# Altium schematic sheet Modular_BO.SchDoc
size C; SheetNumber: 3; SheetTotal: 4
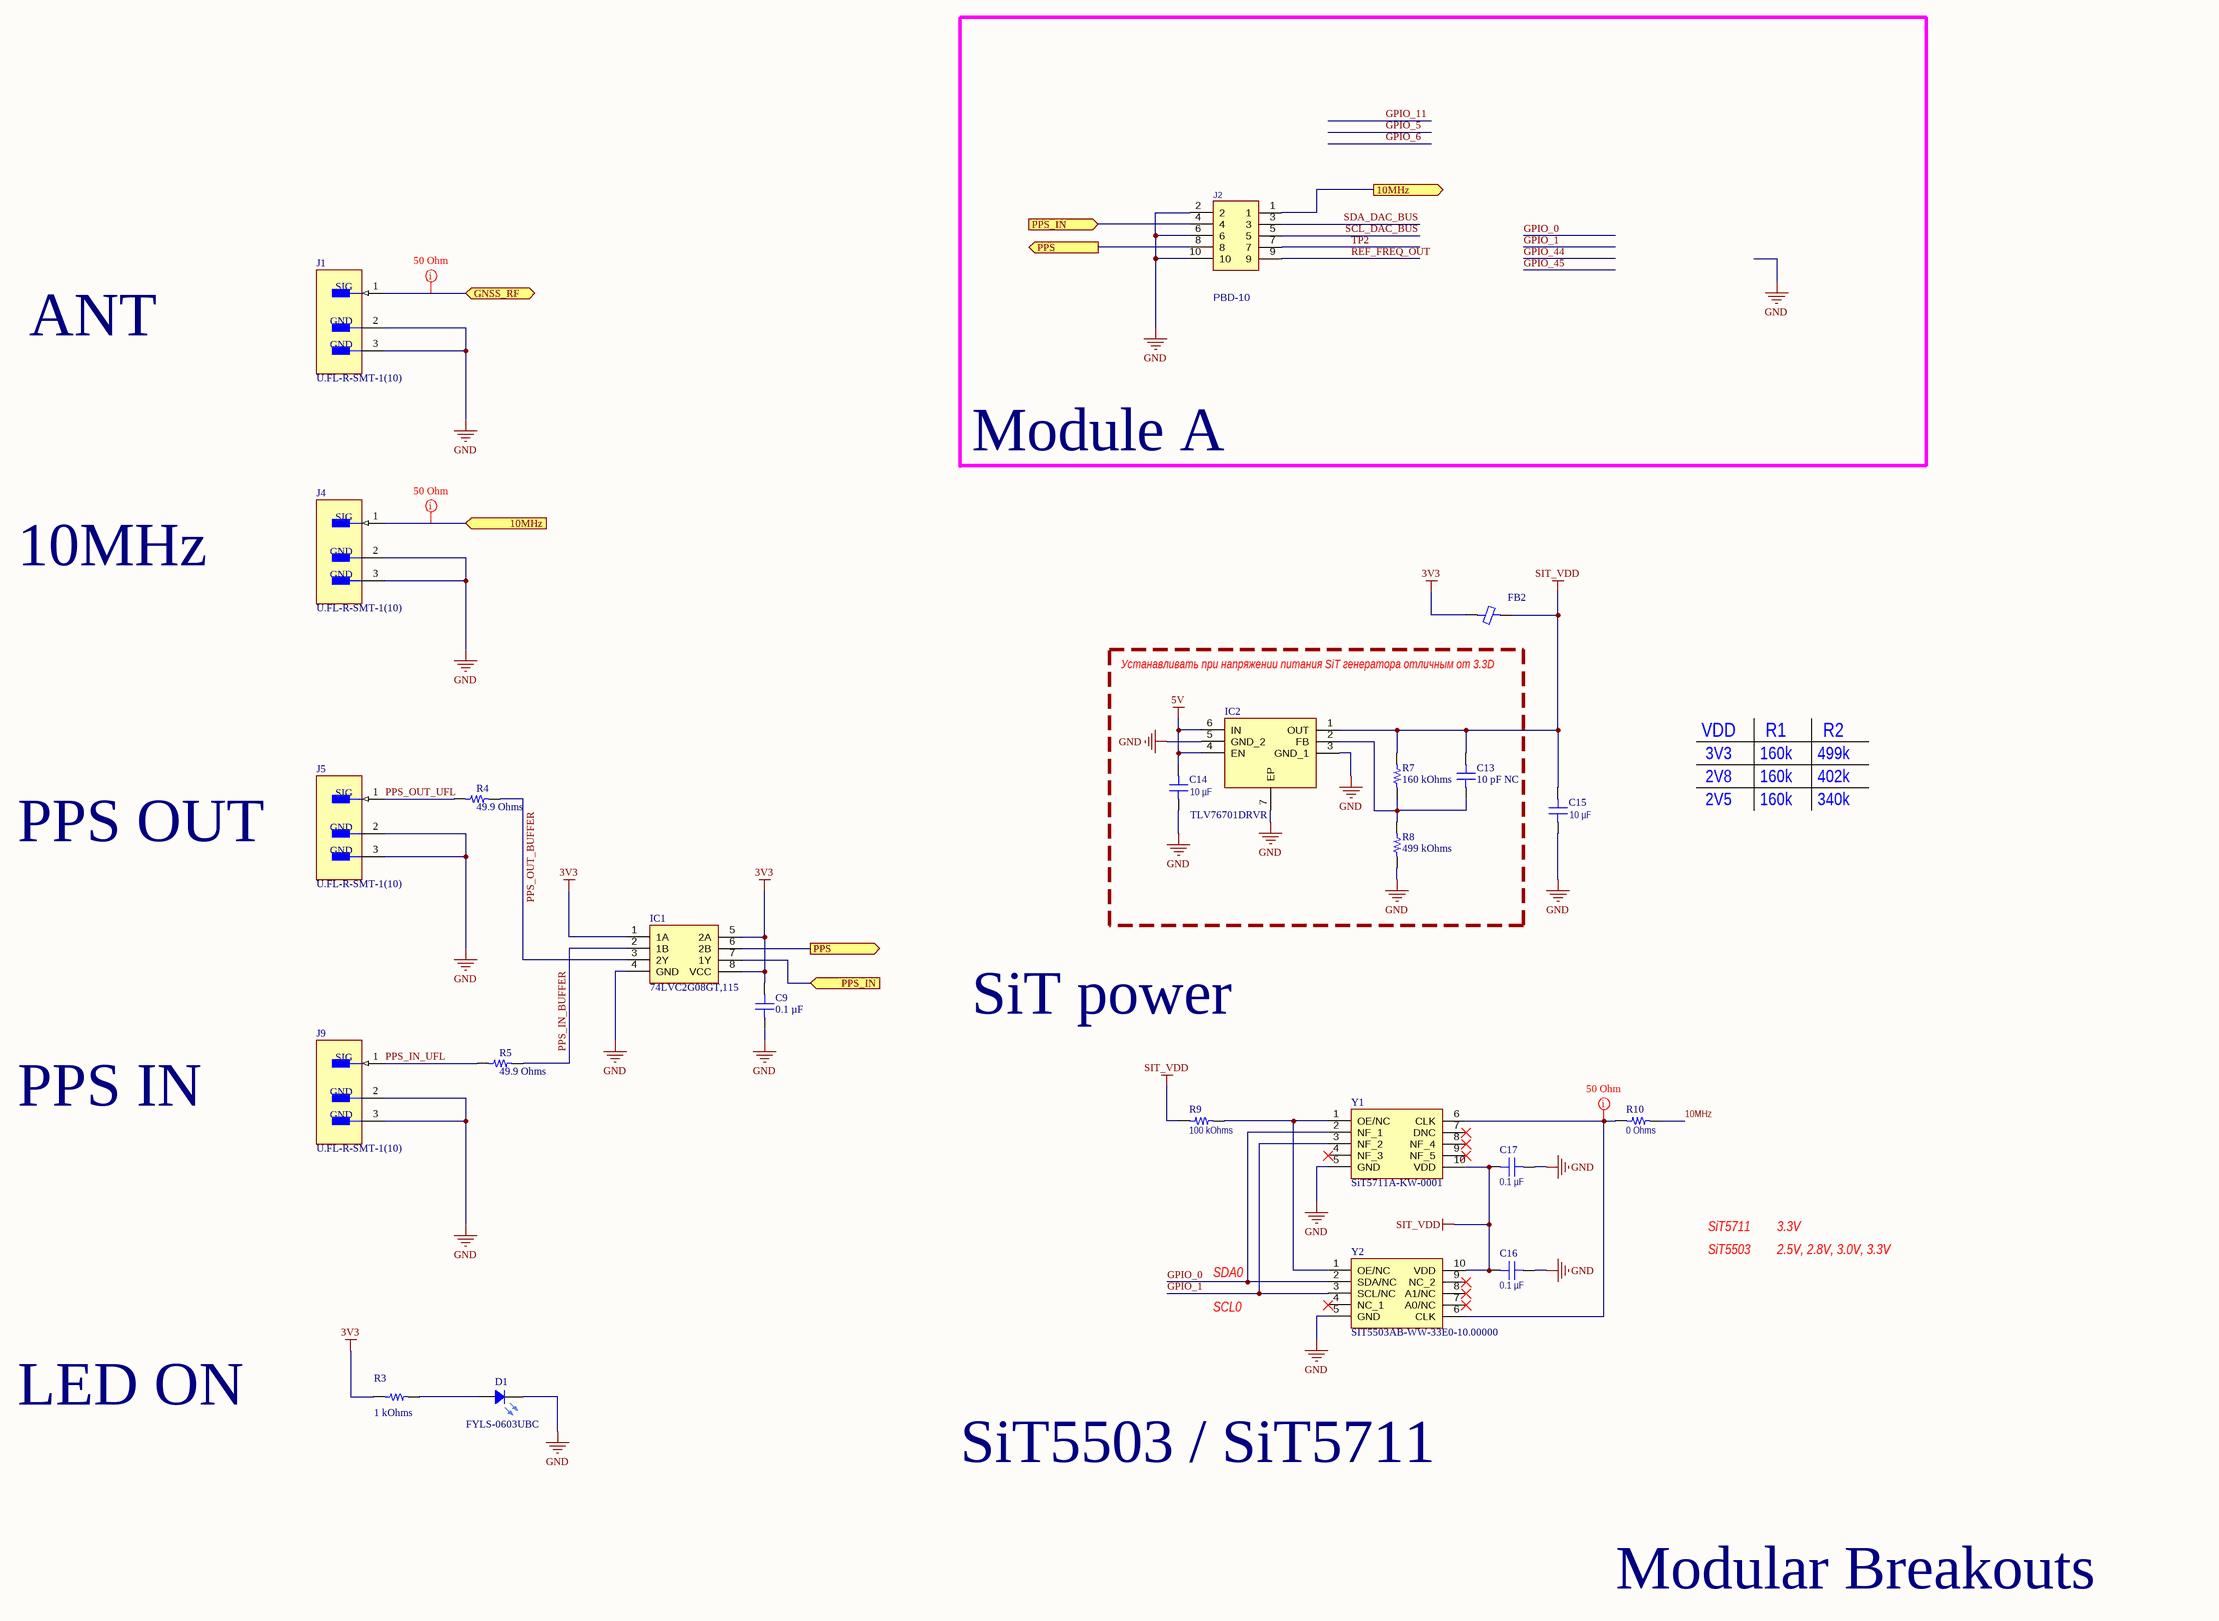
[diagram p0: Modular_BO.SchDoc]

## Parts
C9  0.1 µF  [CAP 0603_1608]
C13  10 pF NC  [CAP 0402_1005]
C14  Capacitance: 10 µF  [CAP 0603_1608]  (hidden comment: CC0603MRX5R6BB106)
C15  Capacitance: 10 µF  [CAP 0603_1608]  (hidden comment: CC0603MRX5R6BB106)
C16  0.1 µF  [CAP 0603_1608]
C17  0.1 µF  [CAP 0603_1608]
D1  FYLS-0603UBC  [LEDC1608X55N_BLUE]
FB2  1 kOhms @ 100 MHz  [FER 0603_1608]  (value not drawn)
IC1  74LVC2G08GT,115  [74AVC9112GTX]
IC2  TLV76701DRVR  [SON65P200X200X80-7N]
J1  U.FL-R-SMT-1(10)  [FP-U_FL-R-SMT-1_10-MFG]
J2  PBD-10  [PBD-10]
J4  U.FL-R-SMT-1(10)  [FP-U_FL-R-SMT-1_10-MFG]
J5  U.FL-R-SMT-1(10)  [FP-U_FL-R-SMT-1_10-MFG]
J9  U.FL-R-SMT-1(10)  [FP-U_FL-R-SMT-1_10-MFG]
R3  1 kOhms  [YAGEO RES 0603_1608]
R4  49.9 Ohms  [YAGEO RES 0603_1608]
R5  49.9 Ohms  [YAGEO RES 0603_1608]
R7  160 kOhms  [YAGEO RES 0402_1005]
R8  499 kOhms  [YAGEO RES 0402_1005]
R9  100 kOhms  [YAGEO RES 0603_1608]
R10  0 Ohms  [YAGEO RES 0603_1608]
Y1  SiT5711A-KW-0001  [Emerald_9070_10pins_2022]
Y2  SIT5503AB-WW-33E0-10.00000  [Ceramic_QFN_7050_10pins]

## Blocks framed on the sheet
Module A: J2

## Ports
10MHz (in), 10MHz (out), GNSS_RF (bidir), PPS (out), PPS_IN (in)

## Nets
3V3: C9.2 FB2.1 IC1.1(1A) IC1.5(2A) IC1.8(VCC) R3.1
5V: C14.2 IC2.4(EN) IC2.6(IN)
GND: C9.1 C14.1 C15.1 C16.1 C17.1 D1.1(A) IC1.4(GND) IC2.3(GND_1) IC2.5(GND_2) IC2.7(EP) J1.2(GND) J1.3(GND) J2.2 J2.6 J2.10 J4.2(GND) J4.3(GND) J5.2(GND) J5.3(GND) J9.2(GND) J9.3(GND) R8.1 Y1.5(GND) Y2.5(GND)
SIT_VDD: C13.2 C15.2 C16.2 C17.2 FB2.2 IC2.1(OUT) R7.2 R9.1 Y1.10(VDD) Y2.10(VDD)
10MHz: J2.1 J4.1(SIG) ; port 10MHz
10MHz: R10.1  [a separate net that carries the same name]
GNSS_RF: J1.1(SIG) ; port GNSS_RF
GPIO_0: Y1.2(NF_1) Y2.2(SDA/NC)
GPIO_1: Y1.3(NF_2) Y2.3(SCL/NC)
PPS: IC1.6(2B) J2.8 ; port PPS
PPS_IN: IC1.7(1Y) J2.4 ; port PPS_IN
PPS_IN_BUFFER: IC1.2(1B) R5.2
PPS_IN_UFL: J9.1(SIG) R5.1
PPS_OUT_BUFFER: IC1.3(2Y) R4.2
PPS_OUT_UFL: J5.1(SIG) R4.1
REF_FREQ_OUT: J2.9
SCL_DAC_BUS: J2.5
SDA_DAC_BUS: J2.3
TP2: J2.7
NetC13_1: C13.1 IC2.2(FB) R7.1 R8.2
NetD1_2: D1.2(C) R3.2
NetR9_2: R9.2 Y1.1(OE/NC) Y2.1(OE/NC)
NetR10_2: R10.2 Y1.6(CLK) Y2.6(CLK)

Not connected (* = marked no-connect by the designer): Y1 4(NF_3)* 7(DNC)* 8(NF_4)* 9(NF_5)*; Y2 4(NC_1)* 7(A0/NC)* 8(A1/NC)* 9(NC_2)*

## Layout directives
net class RF: 10MHz, GNSS_RF, NetR10_2

## Notes on the sheet
- ANT
- 10MHz
- Устанавливать при напряжении питания SiT генератора отличным от 3.3D
- VDD
- 3V3
- R1
- 160k
- R2
- 499k
- 2V5
- 2V8
- 402k
- 340k
- PPS OUT
- SiT power
- PPS IN
- SiT5711
- SiT5503
- 3.3V
- 2.5V, 2.8V, 3.0V, 3.3V
- SDA0
- SCL0
- LED ON
- SiT5503 / SiT5711
- Modular Breakouts
- DWG. NO.
- REV.
- SHT.
- REVISION
- DESCRIPTION
- DATE
- APPROVED
- THIS DOCUMENT AND THE DATA DISCLOSED HEREIN OR HEREWITH IS THE PROPERTY OF ALTIUM LIMITED AND MAY BE FREELY DISTRIBUTED IN WHOLE. NO RIGHTS ARE RESERVED OR EXPRESS OR IMPLIED WARANTEE GIVEN.
- ENG:
- DSN:
- APPROVALS
- PROJECT
- DOCUMENT REVISION:
- DESIGN ITEM:
- CHK:
- BOM:
- REFERENCE DOCUMENTS
- PROJECT REVISION:
- TITLE
- FAB DWG:
- PCB DWG:
- ASSY DWG:
- SCALE:
- SIZE
- C
- CAGE CODE
- FILE NAME
- DWG NO.
- SHEET
- OF
- REV

## Library data of the parts
C9 C16 C17 = CC0603KRX7R9BB104: CAP CER 0.1UF 50V X7R 0603; manufacturer: Yageo; Tolerance: ±10%; componentlink2url: https://www.digikey.com/en/products/detail/yageo/CC0603KRX7R9BB104/2103082; Value: 0.1 µF; componentlink2description: DigiKey Link; Temperature Coefficient: X7R; Capacitance: 0.1 µF; Part Number: CC0603KRX7R9BB104; Applications: General Purpose; componentlink1description: Datasheet; componentlink1url: https://www.yageo.com/upload/media/product/productsearch/datasheet/mlcc/UPY-GPHC_X7R_6.3V-to-50V_18.pdf; Device Package: 0603 (1608 Metric); lastupdated: 09.02.2024 20:10:21; Lifecycle Status: Active; Minimum Order: 1; Mounting Type: Surface Mount, MLCC; Operating Temperature: -55°C ~ 125°C; Package / Case: 0603 (1608 Metric); packaging: TapeAndReel; partid: 9506; Part Status: Active; price: 0.01; series: CC; Size / Dimension: 0.063" L x 0.031" W (1.60mm x 0.80mm); Supplier 1: DigiKey; Supplier Part Number 1: 311-1344-1-ND; Thickness (Max): 0.035" (0.90mm); Voltage - Rated: 50V
C13 = CC0402KRNPO9BN100: CAP CER 10PF 50V C0G/NPO 0402; manufacturer: Yageo; Temperature Coefficient: C0G, NP0; Tolerance: ±10%; Part Number: CC0402KRNPO9BN100; Value: 10 pF NC; Applications: General Purpose; Capacitance: 10 pF; componentlink1description: Datasheet; componentlink1url: https://www.yageo.com/upload/media/product/productsearch/datasheet/mlcc/UPY-GP_NP0_16V-to-50V_18.pdf; componentlink2description: DigiKey Link; componentlink2url: https://www.digikey.com/en/products/detail/yageo/CC0402KRNPO9BN100/11489535; Device Package: 0402 (1005 Metric); lastupdated: 09.02.2024 20:03:43; Lifecycle Status: Active; Minimum Order: 10; Mounting Type: Surface Mount, MLCC; Operating Temperature: -55°C ~ 125°C; Package / Case: 0402 (1005 Metric); packaging: CutTape; partid: 52087; Part Status: Active; price: 0.01; series: CC; Size / Dimension: 0.039" L x 0.020" W (1.00mm x 0.50mm); Supplier 1: DigiKey; Supplier Part Number 1: 13-CC0402KRNPO9BN100CT-ND; Thickness (Max): 0.022" (0.55mm); Voltage - Rated: 50V
C14 C15 = CC0603MRX5R6BB106: CAP CER 10UF 10V X5R 0603; manufacturer: Yageo; Tolerance: ±20%; Part Number: CC0603MRX5R6BB106; Applications: General Purpose; componentlink1description: Datasheet; componentlink1url: https://www.yageo.com/upload/media/product/productsearch/datasheet/mlcc/UPY-GPHC_X5R_4V-to-50V_25.pdf; componentlink2description: DigiKey Link; componentlink2url: https://www.digikey.com/en/products/detail/yageo/CC0603MRX5R6BB106/5195224; Device Package: 0603 (1608 Metric); lastupdated: 09.02.2024 20:10:01; Lifecycle Status: Active; Minimum Order: 1; Mounting Type: Surface Mount, MLCC; Operating Temperature: -55°C ~ 85°C; Package / Case: 0603 (1608 Metric); packaging: TapeAndReel; partid: 41195; Part Status: Active; price: 0.02; series: CC; Size / Dimension: 0.063" L x 0.031" W (1.60mm x 0.80mm); Supplier 1: DigiKey; Supplier Part Number 1: 311-1817-1-ND; Temperature Coefficient: X5R; Thickness (Max): 0.039" (1.00mm); Voltage - Rated: 10V
D1 = FYLS-0603UBC: LED, 0603, BLUE; Manufacturer_Name: FORYARD; Height: 0.6mm; Datasheet Link: https://v4.cecdn.yun300.cn/100001_2003185297/7%20FYLS-0603BXXXC-D.pdf; Manufacturer_Part_Number: FYLS-0603UBC
FB2 = BLM18HG102SH1D: FERRITE BEAD 1K OHM 0603 1LN; Manufacturer: Murata Electronics; Number of Lines: 1; Current Rating (Max): 100mA; DC Resistance (DCR) (Max): 1.6Ohm; Ratings: AEC-Q200; Packaging: TapeAndReel; Part Number: BLM18HG102SH1D; ComponentLink1Description: Datasheet; ComponentLink1URL: https://www.murata.com/en-us/products/productdata/8796750675998/QNFA9104.pdf; ComponentLink2Description: DigiKey Link; ComponentLink2URL: https://www.digikey.com/en/products/detail/murata-electronics/BLM18HG102SH1D/2588039; Device Package: 0603 (1608 Metric); Height (Max): 0.037" (0.95mm); Impedance @ Frequency: 1 kOhms @ 100 MHz; LastUpdated: 03.06.2024 19:51:54; Lifecycle Status: Active; Minimum Order: 1; Mounting Type: Surface Mount; Operating Temperature: -55°C ~ 125°C; Package / Case: 0603 (1608 Metric); PartId: 731; Part Status: Active; Price: 0.05; Series: EMIFIL®, BLM18; Size / Dimension: 0.063" L x 0.032" W (1.60mm x 0.80mm); Supplier 1: DigiKey; Supplier Part Number 1: 490-11033-1-ND; Value: 1 kOhms @ 100 MHz
IC1 = 74LVC2G08GT,115: Integrated Circuit; Manufacturer_Name: Nexperia; Datasheet Link: https://assets.nexperia.com/documents/data-sheet/74LVC2G08.pdf; Height: 0.5mm; Manufacturer_Part_Number: 74LVC2G08GT,115; Mouser Part Number: 771-LVC2G08GT115; Mouser Price/Stock: https://www.mouser.co.uk/ProductDetail/Nexperia/74LVC2G08GT115?qs=me8TqzrmIYX6ucYoPcZnUg%3D%3D; Arrow Part Number: 74LVC2G08GT,115; Arrow Price/Stock: https://www.arrow.com/en/products/74lvc2g08gt115/nexperia?region=europe
IC2 = TLV76701DRVR: IC REG LINEAR POS ADJ 1A 6WSON; Manufacturer_Name: Texas Instruments; Datasheet Link: http://www.ti.com/lit/gpn/TLV767; Height: 0.8mm; Manufacturer_Part_Number: TLV76701DRVR; Mouser Part Number: 595-TLV76701DRVR; Mouser Price/Stock: https://www.mouser.co.uk/ProductDetail/Texas-Instruments/TLV76701DRVR?qs=l7cgNqFNU1h4nW14BHdGSQ%3D%3D; Arrow Part Number: TLV76701DRVR; Arrow Price/Stock: https://www.arrow.com/en/products/tlv76701drvr/texas-instruments?region=nac
J1 J4 J5 J9 = CMP-2000-05152-3: CONN U.FL RCPT STR 50 OHM SMD; Max Frequency: 6GHz; Connector Type: Coaxial; Body Plating: Silver; Body Material: Bronze; Impedance: 50R; Dielectric Material: Polymer; Insulation Resistance: 500MR; Gender: Male; Packaging: Cut Tape; Length: 3mm; Package Quantity: 2500; Termination: Solder; Lead Free: Lead Free; Series: U.FL; Min Operating Temperature: -40°C; Fastening Type: Snap; Contact Material: Brass; Orientation: Straight; Wire/Cable Type: Coaxial; Frequency: 6GHz; Contact Plating: Gold; Depth: 3.1mm; Weight: 0.001764oz; Max Operating Temperature: 90°C; Radiation Hardening: No; REACH SVHC: No SVHC; Mount: Surface Mount; Housing Color: Beige
J2 = PBD-10_1: Connector; Manufacturer: Connfly; Part Number1: DS-1023-2x5; Part Number: PBD-10; System: Connector
R3 = RC0603FR-071KL: RES 1K OHM 1% 1/10W 0603; Manufacturer: Yageo; Power (Watts): 0.1W, 1/10W; Temperature Coefficient: ±100ppm/°C; Part Number: RC0603FR-071KL; Value: 1 kOhms; ComponentLink1Description: Datasheet; ComponentLink1URL: https://www.yageo.com/upload/media/product/productsearch/datasheet/rchip/PYu-RC_Group_51_RoHS_L_10.pdf; ComponentLink2Description: DigiKey Link; ComponentLink2URL: https://www.digikey.com/en/products/detail/yageo/RC0603FR-071KL/726843; Composition: Thick Film; Device Package: 0603 (1608 Metric); Features: Moisture Resistant; Height - Seated (Max): 0.022" (0.55mm); LastUpdated: 25.07.2024 9:19:19; Lifecycle Status: Active; Minimum Order: 1; Number of Terminations: 2; Operating Temperature: -55°C ~ 155°C; Package / Case: 0603 (1608 Metric); Packaging: CutTape; PartId: 22600; Part Status: Active; Price: 0.01; Resistance: 1 kOhms; Series: RC_L; Size / Dimension: 0.063" L x 0.031" W (1.60mm x 0.80mm); Supplier 1: DigiKey; Supplier Part Number 1: 311-1.00KHRCT-ND; Supplier Device Package: 0603; Tolerance: ±1%
R4 R5 = RC0603FR-0749R9L: RES 49.9 OHM 1% 1/10W 0603; Manufacturer: Yageo; Power (Watts): 0.1W, 1/10W; Temperature Coefficient: ±100ppm/°C; Packaging: CutTape; ComponentLink2Description: DigiKey Link; ComponentLink1Description: Datasheet; ComponentLink2URL: https://www.digikey.com/en/products/detail/yageo/RC0603FR-0749R9L/727264; ComponentLink1URL: https://www.yageo.com/upload/media/product/productsearch/datasheet/rchip/PYu-RC_Group_51_RoHS_L_10.pdf; Part Number: RC0603FR-0749R9L; Value: 49.9 Ohms; Composition: Thick Film; Device Package: 0603 (1608 Metric); Features: Moisture Resistant; Height - Seated (Max): 0.022" (0.55mm); LastUpdated: 25.07.2024 9:19:17; Lifecycle Status: Active; Minimum Order: 1; Number of Terminations: 2; Operating Temperature: -55°C ~ 155°C; Package / Case: 0603 (1608 Metric); PartId: 23951; Part Status: Active; Price: 0.01; Resistance: 49.9 Ohms; Series: RC_L; Size / Dimension: 0.063" L x 0.031" W (1.60mm x 0.80mm); Supplier 1: DigiKey; Supplier Part Number 1: 311-49.9HRCT-ND; Supplier Device Package: 0603; Tolerance: ±1%
R7 = RC0402FR-07160KL: RES 160K OHM 1% 1/16W 0402; Manufacturer: Yageo; Power (Watts): 0.063W, 1/16W; Temperature Coefficient: ±100ppm/°C; Part Number: RC0402FR-07160KL; Value: 160 kOhms; ComponentLink1Description: Datasheet; ComponentLink1URL: https://www.yageo.com/upload/media/product/productsearch/datasheet/rchip/PYu-RC_Group_51_RoHS_L_10.pdf; ComponentLink2Description: DigiKey Link; ComponentLink2URL: https://www.digikey.com/en/products/detail/yageo/RC0402FR-07160KL/5280856; Composition: Thick Film; Device Package: 0402 (1005 Metric); Features: Moisture Resistant; Height - Seated (Max): 0.016" (0.40mm); LastUpdated: 25.07.2024 9:18:19; Lifecycle Status: Active; Minimum Order: 1; Number of Terminations: 2; Operating Temperature: -55°C ~ 155°C; Package / Case: 0402 (1005 Metric); Packaging: CutTape; PartId: 2582; Part Status: Active; Price: 0.01; Resistance: 160 kOhms; Series: RC_L; Size / Dimension: 0.039" L x 0.020" W (1.00mm x 0.50mm); Supplier 1: DigiKey; Supplier Part Number 1: YAG2996CT-ND; Supplier Device Package: 0402; Tolerance: ±1%
R8 = RC0402FR-07499KL: RES 499K OHM 1% 1/16W 0402; Manufacturer: Yageo; Power (Watts): 0.063W, 1/16W; Temperature Coefficient: ±100ppm/°C; Part Number: RC0402FR-07499KL; Value: 499 kOhms; ComponentLink1Description: Datasheet; ComponentLink1URL: https://www.yageo.com/upload/media/product/productsearch/datasheet/rchip/PYu-RC_Group_51_RoHS_L_10.pdf; ComponentLink2Description: DigiKey Link; ComponentLink2URL: https://www.digikey.com/en/products/detail/yageo/RC0402FR-07499KL/726622; Composition: Thick Film; Device Package: 0402 (1005 Metric); Features: Moisture Resistant; Height - Seated (Max): 0.016" (0.40mm); LastUpdated: 25.07.2024 9:18:19; Lifecycle Status: Active; Minimum Order: 1; Number of Terminations: 2; Operating Temperature: -55°C ~ 155°C; Package / Case: 0402 (1005 Metric); Packaging: CutTape; PartId: 2647; Part Status: Active; Price: 0.01; Resistance: 499 kOhms; Series: RC_L; Size / Dimension: 0.039" L x 0.020" W (1.00mm x 0.50mm); Supplier 1: DigiKey; Supplier Part Number 1: 311-499KLRCT-ND; Supplier Device Package: 0402; Tolerance: ±1%
R9 = RC0603FR-07100KL: RES 100K OHM 1% 1/10W 0603; Manufacturer: Yageo; Power (Watts): 0.1W, 1/10W; Temperature Coefficient: ±100ppm/°C; Part Number: RC0603FR-07100KL; Value: 100 kOhms; ComponentLink1Description: Datasheet; ComponentLink1URL: https://www.yageo.com/upload/media/product/productsearch/datasheet/rchip/PYu-RC_Group_51_RoHS_L_10.pdf; ComponentLink2Description: DigiKey Link; ComponentLink2URL: https://www.digikey.com/en/products/detail/yageo/RC0603FR-07100KL/726889; Composition: Thick Film; Device Package: 0603 (1608 Metric); Features: Moisture Resistant; Height - Seated (Max): 0.022" (0.55mm); LastUpdated: 25.07.2024 9:19:17; Lifecycle Status: Active; Minimum Order: 1; Number of Terminations: 2; Operating Temperature: -55°C ~ 155°C; Package / Case: 0603 (1608 Metric); Packaging: CutTape; PartId: 23948; Part Status: Active; Price: 0.01; Resistance: 100 kOhms; Series: RC_L; Size / Dimension: 0.063" L x 0.031" W (1.60mm x 0.80mm); Supplier 1: DigiKey; Supplier Part Number 1: 311-100KHRCT-ND; Supplier Device Package: 0603; Tolerance: ±1%
R10 = RC0603FR-070RL: RES 0 OHM JUMPER 1/10W 0603; Manufacturer: Yageo; Power (Watts): 0.1W, 1/10W; Part Number: RC0603FR-070RL; Value: 0 Ohms; ComponentLink1Description: Datasheet; ComponentLink1URL: https://www.yageo.com/upload/media/product/productsearch/datasheet/rchip/PYu-RC_Group_51_RoHS_L_10.pdf; ComponentLink2Description: DigiKey Link; ComponentLink2URL: https://www.digikey.com/en/products/detail/yageo/RC0603FR-070RL/1304008; Composition: Thick Film; Device Package: 0603 (1608 Metric); Features: Moisture Resistant; Height - Seated (Max): 0.022" (0.55mm); LastUpdated: 25.07.2024 9:19:19; Lifecycle Status: Active; Minimum Order: 1; Number of Terminations: 2; Operating Temperature: -55°C ~ 155°C; Package / Case: 0603 (1608 Metric); Packaging: CutTape; PartId: 22614; Part Status: Active; Price: 0.01; Resistance: 0 Ohms; Series: RC_L; Size / Dimension: 0.063" L x 0.031" W (1.60mm x 0.80mm); Supplier 1: DigiKey; Supplier Part Number 1: 311-0.0HRCT-ND; Supplier Device Package: 0603; Tolerance: Jumper
Y1 = SiT5711A-KW-0001: Crystal or Oscillator; Manufacturer_Name: SiTime; Datasheet Link: https://www.sitime.com/support/resource-library/datasheets/sit5711-datasheet; Height: 6.19mm; Manufacturer_Part_Number: SiT5711A-KW-0001
Y2 = SIT5503AB-WW-33E0-10.00000: Crystal or Oscillator; Manufacturer_Name: SiTime; Height: 2.2mm; Manufacturer_Part_Number: SIT5503AB-WW-33E0-10.00000